# EAGLE design AudioAmp (EAGLE 7.6.0)
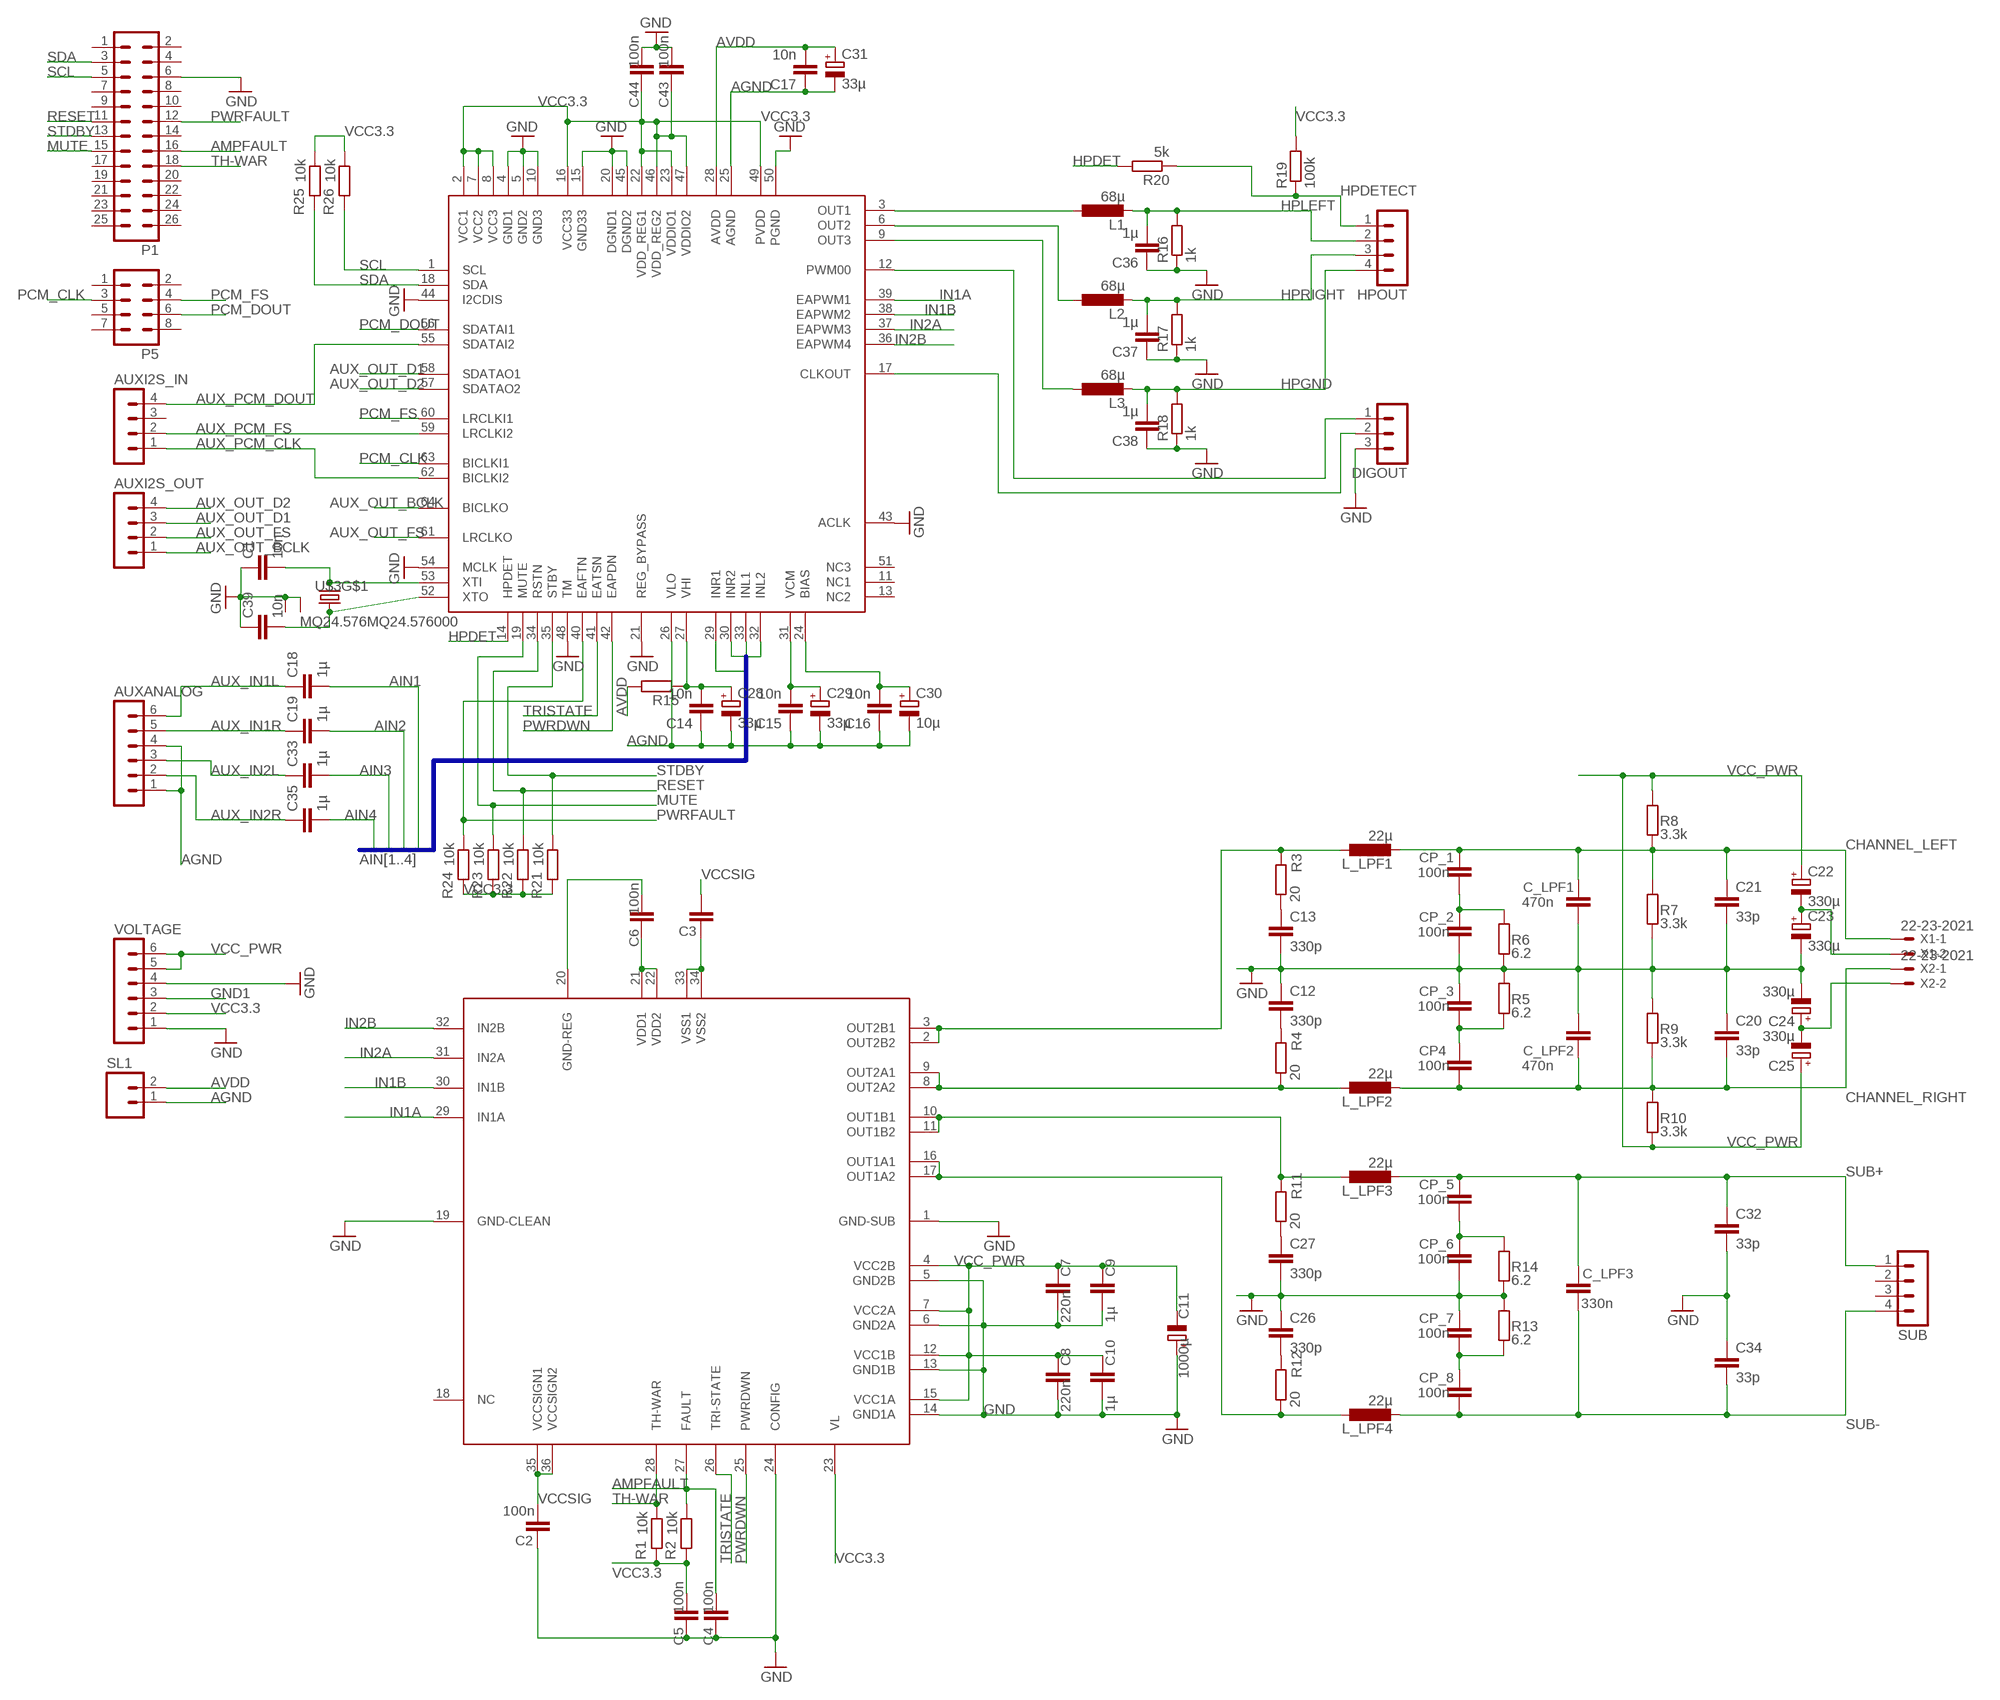
[diagram p0: schematic, sheet 1]

## Parts
AUXANALOG  MA06-1  [MA06-1]
AUXI2S_IN  MA04-1  [MA04-1]
AUXI2S_OUT  MA04-1  [MA04-1]
C1  10n  C-EUC1812  [C1812]
C2  100n  C_EU_SMD2824  [2824]
C3  C_EU_SMD2824  [2824]
C4  100n  C_EU_SMD2824  [2824]
C5  100n  C_EU_SMD2824  [2824]
C6  100n  C_EU_SMD2824  [2824]
C7  220n  C_EU_SMD2824  [2824]
C8  220n  C_EU_SMD2824  [2824]
C9  1µ  C_EU_SMD2824  [2824]
C10  1µ  C_EU_SMD2824  [2824]
C11  1000µ  CPOL-EUJ  [PANASONIC_J]
C12  330p  C-EU050-024X044  [C050-024X044]
C13  330p  C-EU050-024X044  [C050-024X044]
C14  10n  C-EUC1812  [C1812]
C15  10n  C-EUC1812  [C1812]
C16  10n  C-EUC1812  [C1812]
C17  10n  C-EUC1812  [C1812]
C18  1µ  C-EU050-045X075  [C050-045X075]
C19  1µ  C-EU050-045X075  [C050-045X075]
C20  33p  C-EU050-024X044  [C050-024X044]
C21  33p  C-EU050-024X044  [C050-024X044]
C22  330µ  CPOL-EUE2.5-7  [E2,5-7]
C23  330µ  CPOL-EUE2.5-7  [E2,5-7]
C24  330µ  CPOL-EUE2.5-7  [E2,5-7]
C25  330µ  CPOL-EUE2.5-7  [E2,5-7]
C26  330p  C-EU050-024X044  [C050-024X044]
C27  330p  C-EU050-024X044  [C050-024X044]
C28  33µ  CPOL-EUE2.5-5  [E2,5-5]
C29  33µ  CPOL-EUE2.5-5  [E2,5-5]
C30  10µ  CPOL-EUE2.5-5  [E2,5-5]
C31  33µ  CPOL-EUE2.5-5  [E2,5-5]
C32  33p  C-EU050-024X044  [C050-024X044]
C33  1µ  C-EU050-045X075  [C050-045X075]
C34  33p  C-EU050-024X044  [C050-024X044]
C35  1µ  C-EU050-045X075  [C050-045X075]
C36  1µ  C-EU050-045X075  [C050-045X075]
C37  1µ  C-EU050-045X075  [C050-045X075]
C38  1µ  C-EU050-045X075  [C050-045X075]
C39  10n  C-EUC1812  [C1812]
C43  100n  C_EU_SMD2824  [2824]
C44  100n  C_EU_SMD2824  [2824]
C_LPF1  470n  C_EU_SMD2824  [2824]
C_LPF2  470n  C_EU_SMD2824  [2824]
C_LPF3  330n  C_EU_SMD2824  [2824]
CP4  100n  C_EU_SMD2824  [2824]
CP_1  100n  C_EU_SMD2824  [2824]
CP_2  100n  C_EU_SMD2824  [2824]
CP_3  100n  C_EU_SMD2824  [2824]
CP_5  100n  C_EU_SMD2824  [2824]
CP_6  100n  C_EU_SMD2824  [2824]
CP_7  100n  C_EU_SMD2824  [2824]
CP_8  100n  C_EU_SMD2824  [2824]
DIGOUT  MA03-1  [MA03-1]
HPOUT  MA04-1  [MA04-1]
L1  68µ  L-EU0204V  [0204V]
L2  68µ  L-EU0204V  [0204V]
L3  68µ  L-EU0204V  [0204V]
L_LPF1  22µ  L-EUL-PISR  [PISR]
L_LPF2  22µ  L-EUL-PISR  [PISR]
L_LPF3  22µ  L-EUL-PISR  [PISR]
L_LPF4  22µ  L-EUL-PISR  [PISR]
P1  MA13-2  [MA13-2]
P5  MA04-2  [MA04-2]
R1  10k  R-EU_R1206  [R1206]
R2  10k  R-EU_R1206  [R1206]
R3  20  R-EU_R1206  [R1206]
R4  20  R-EU_R1206  [R1206]
R5  6.2  R-EU_R1206  [R1206]
R6  6.2  R-EU_R1206  [R1206]
R7  3.3k  R-EU_R1206  [R1206]
R8  3.3k  R-EU_R1206  [R1206]
R9  3.3k  R-EU_R1206  [R1206]
R10  3.3k  R-EU_R1206  [R1206]
R11  20  R-EU_R1206  [R1206]
R12  20  R-EU_R1206  [R1206]
R13  6.2  R-EU_R1206  [R1206]
R14  6.2  R-EU_R1206  [R1206]
R15  R-EU_0204/7  [0204/7]
R16  1k  R-EU_0204/2V  [0204V]
R17  1k  R-EU_0204/2V  [0204V]
R18  1k  R-EU_0204/2V  [0204V]
R19  100k  R-EU_0204/7  [0204/7]
R20  5k  R-EU_0204/7  [0204/7]
R21  10k  R-EU_R1206  [R1206]
R22  10k  R-EU_R1206  [R1206]
R23  10k  R-EU_R1206  [R1206]
R24  10k  R-EU_R1206  [R1206]
R25  10k  R-EU_R1206  [R1206]
R26  10k  R-EU_R1206  [R1206]
SL1  M02  [02P]
SUB  MA04-1  [MA04-1]
U$1  STA510F  [PSSO-36SD]
U$2  STA321  [LQFP-ST-64-2]
U$3  MQ24.576MQ24.576000  [MQ4]
VOLTAGE  MA06-1  [MA06-1]
X1  22-23-2021  [22-23-2021]
X2  22-23-2021  [22-23-2021]

## Nets
AGND: AUXANALOG.1 AUXANALOG.4 C14.1 C15.1 C16.1 C17.1 C28.- C29.- C30.- C31.- SL1.1 U$2.25(AGND) U$2.26(VLO)
AIN1: C18.2 U$2.33(INL1)
AIN2: C19.2 U$2.29(INR1)
AIN3: C33.2 U$2.32(INL2)
AIN4: C35.2 U$2.30(INR2)
AMPFAULT: C4.2 P1.16 R2.1 U$1.27(FAULT)
AUX_IN1L: AUXANALOG.6 C18.1
AUX_IN1R: AUXANALOG.5 C19.1
AUX_IN2L: AUXANALOG.3 C33.1
AUX_IN2R: AUXANALOG.2 C35.1
AUX_OUT_BCLK: AUXI2S_OUT.1 U$2.64(BICLKO)
AUX_OUT_D1: AUXI2S_OUT.3 U$2.58(SDATAO1)
AUX_OUT_D2: AUXI2S_OUT.4 U$2.57(SDATAO2)
AUX_OUT_FS: AUXI2S_OUT.2 U$2.61(LRCLKO)
AUX_PCM_CLK: AUXI2S_IN.1 U$2.62(BICLKI2)
AUX_PCM_DOUT: AUXI2S_IN.4 U$2.55(SDATAI2)
AUX_PCM_FS: AUXI2S_IN.2 U$2.59(LRCLKI2)
AVDD: C17.2 C31.+ R15.2 SL1.2 U$2.28(AVDD)
CHANNEL_LEFT: C21.1 C_LPF1.2 CP_1.2 L_LPF1.2 R7.2 R8.1 X1.1
CHANNEL_RIGHT: C20.2 C_LPF2.1 CP4.1 L_LPF2.2 R9.1 R10.2 X2.1
GND: C1.1 C2.1 C4.1 C5.1 C7.2 C8.2 C9.2 C10.2 C11.+ C12.1 C13.2 C20.1 C21.2 C23.- C24.- C26.1 C27.2 C32.2 C34.1 C36.1 C37.1 C38.1 C39.1 C43.2 C44.2 C_LPF1.1 C_LPF2.2 CP_2.1 CP_3.2 CP_6.1 CP_7.2 DIGOUT.3 P1.6 R5.2 R6.1 R7.1 R9.2 R13.2 R14.1 R16.1 R17.1 R18.1 U$1.1(GND-SUB) U$1.5(GND2B) U$1.6(GND2A) U$1.13(GND1B) U$1.14(GND1A) U$1.19(GND-CLEAN) U$1.24(CONFIG) U$2.4(GND1) U$2.5(GND2) U$2.10(GND3) U$2.15(GND33) U$2.20(DGND1) U$2.21(REG_BYPASS) U$2.43(ACLK) U$2.44(I2CDIS) U$2.45(DGND2) U$2.48(TM) U$2.50(PGND) U$2.54(MCLK) U$3.P$2(GND) U$3.P$4(GND) VOLTAGE.1 VOLTAGE.4
GND1: VOLTAGE.3
HPDET: R20.2 U$2.14(HPDET)
HPDETECT: HPOUT.1 R19.1 R20.1
HPGND: C38.2 HPOUT.4 L3.2 R18.2
HPLEFT: C36.2 HPOUT.2 L1.2 R16.2
HPRIGHT: C37.2 HPOUT.3 L2.2 R17.2
IN1A: U$1.29(IN1A) U$2.39(EAPWM1)
IN1B: U$1.30(IN1B) U$2.38(EAPWM2)
IN2A: U$1.31(IN2A) U$2.37(EAPWM3)
IN2B: U$1.32(IN2B) U$2.36(EAPWM4)
MUTE: P1.15 R23.1 U$2.19(MUTE)
N$1: C15.2 C29.+ U$2.31(VCM)
N$2: C16.2 C30.+ U$2.24(BIAS)
N$3: C39.2 U$2.52(XTO) U$3.P$1
N$4: C1.2 U$2.53(XTI) U$3.P$3
N$5: C3.1 U$1.33(VSS1) U$1.34(VSS2)
N$6: C6.1 U$1.21(VDD1) U$1.22(VDD2)
N$7: C6.2 U$1.20(GND-REG)
N$8: C12.2 R4.2
N$9: C13.1 R3.1
N$10: C22.- C23.+ X1.2
N$11: L_LPF2.1 R4.1 U$1.8(OUT2A2) U$1.9(OUT2A1)
N$12: L_LPF1.1 R3.2 U$1.2(OUT2B2) U$1.3(OUT2B1)
N$13: C26.2 R12.2
N$14: C27.1 R11.1
N$15: CP4.2 CP_3.1 R5.1
N$16: CP_1.1 CP_2.2 R6.2
N$17: C14.2 C28.+ R15.1 U$2.27(VHI)
N$18: C24.+ C25.- X2.2
N$19: L_LPF3.1 R11.2 U$1.10(OUT1B1) U$1.11(OUT1B2)
N$20: CP_7.1 CP_8.2 R13.1
N$21: CP_5.1 CP_6.2 R14.2
N$22: L_LPF4.1 R12.1 U$1.16(OUT1A1) U$1.17(OUT1A2)
N$24: L1.1 U$2.3(OUT1)
N$25: L2.1 U$2.6(OUT2)
N$26: L3.1 U$2.9(OUT3)
N$30: DIGOUT.1 U$2.12(PWM00)
N$31: DIGOUT.2 U$2.17(CLKOUT)
PCM_CLK: P5.3 U$2.63(BICLKI1)
PCM_DOUT: P5.6 U$2.56(SDATAI1)
PCM_FS: P5.4 U$2.60(LRCLKI1)
PWRDWN: U$1.25(PWRDWN) U$2.42(EAPDN)
PWRFAULT: P1.12 R24.1 U$2.40(EAFTN)
RESET: P1.11 R22.1 U$2.34(RSTN)
SCL: P1.5 R26.2 U$2.1(SCL)
SDA: P1.3 R25.2 U$2.18(SDA)
STDBY: P1.13 R21.1 U$2.35(STBY)
SUB+: C32.1 C_LPF3.2 CP_5.2 L_LPF3.2 SUB.1
SUB-: C34.2 C_LPF3.1 CP_8.1 L_LPF4.2 SUB.4
TH-WAR: P1.18 R1.1 U$1.28(TH-WAR)
TRISTATE: U$1.26(TRI-STATE) U$2.41(EATSN)
VCC3.3: C5.2 C43.1 C44.1 R1.2 R2.2 R19.2 R21.2 R22.2 R23.2 R24.2 R25.1 R26.1 U$1.23(VL) U$2.2(VCC1) U$2.7(VCC2) U$2.8(VCC3) U$2.16(VCC33) U$2.22(VDD_REG1) U$2.23(VDDIO1) U$2.46(VDD_REG2) U$2.47(VDDIO2) U$2.49(PVDD) VOLTAGE.2
VCC_PWR: C7.1 C8.1 C9.1 C10.1 C11.- C22.+ C25.+ R8.2 R10.1 U$1.4(VCC2B) U$1.7(VCC2A) U$1.12(VCC1B) U$1.15(VCC1A) VOLTAGE.5 VOLTAGE.6
VCCSIG: C2.2 C3.2 U$1.35(VCCSIGN1) U$1.36(VCCSIGN2)
Unconnected: AUXI2S_IN.3 P1.1 P1.2 P1.4 P1.7 P1.8 P1.9 P1.10 P1.14 P1.17 P1.19 P1.20 P1.21 P1.22 P1.23 P1.24 P1.25 P1.26 P5.1 P5.2 P5.5 P5.7 P5.8 SUB.2 SUB.3 U$1.18(NC) U$2.11(NC1) U$2.13(NC2) U$2.51(NC3)

## Buses
AIN[1..4]

## Library data of the parts
AUXANALOG VOLTAGE = con-lstb:MA06-1: PIN HEADER; OC_FARNELL: unknown; OC_NEWARK: unknown
AUXI2S_IN AUXI2S_OUT HPOUT SUB = con-lstb:MA04-1: PIN HEADER; OC_FARNELL: unknown; OC_NEWARK: unknown
C1 C12-C21 C26 C27 C32-C39 = rcl:C-EU: CAPACITOR, European symbol
C2-C10 C43 C44 C_LPF1-C_LPF3 CP4 CP_1-CP_3 CP_5-CP_8 = cap_smd_2824:C_EU_SMD*: Author: Dipl.-Ing. FH Rainer Bayer rainer.bayer@hs-heilbronn.de
C11 C22-C25 C28-C31 = rcl:CPOL-EU: POLARIZED CAPACITOR, European symbol
DIGOUT = con-lstb:MA03-1: PIN HEADER; OC_FARNELL: unknown; OC_NEWARK: unknown
L1-L3 L_LPF1-L_LPF4 = rcl:L-EU: INDUCTOR, European symbol
P1 = con-lstb:MA13-2: PIN HEADER; OC_FARNELL: unknown; OC_NEWARK: unknown
P5 = con-lstb:MA04-2: PIN HEADER; OC_FARNELL: unknown; OC_NEWARK: unknown
R1-R26 = rcl:R-EU_: RESISTOR, European symbol
SL1 = con-amp-quick:M02: AMP QUICK CONNECTOR; OC_FARNELL: unknown; OC_NEWARK: unknown
U$1 = ClassD_Amp:STA510F
U$2 = ClassD_Amp:STA321: STA321 4-channel digital audio system
U$3 = crystal:MQ24.576
X1 X2 = con-molex:22-23-2021: .100" (2.54mm) Center Header - 2 Pin; MF: MOLEX; MPN: 22-23-2021; OC_FARNELL: 1462926; OC_NEWARK: 25C3832

## Board
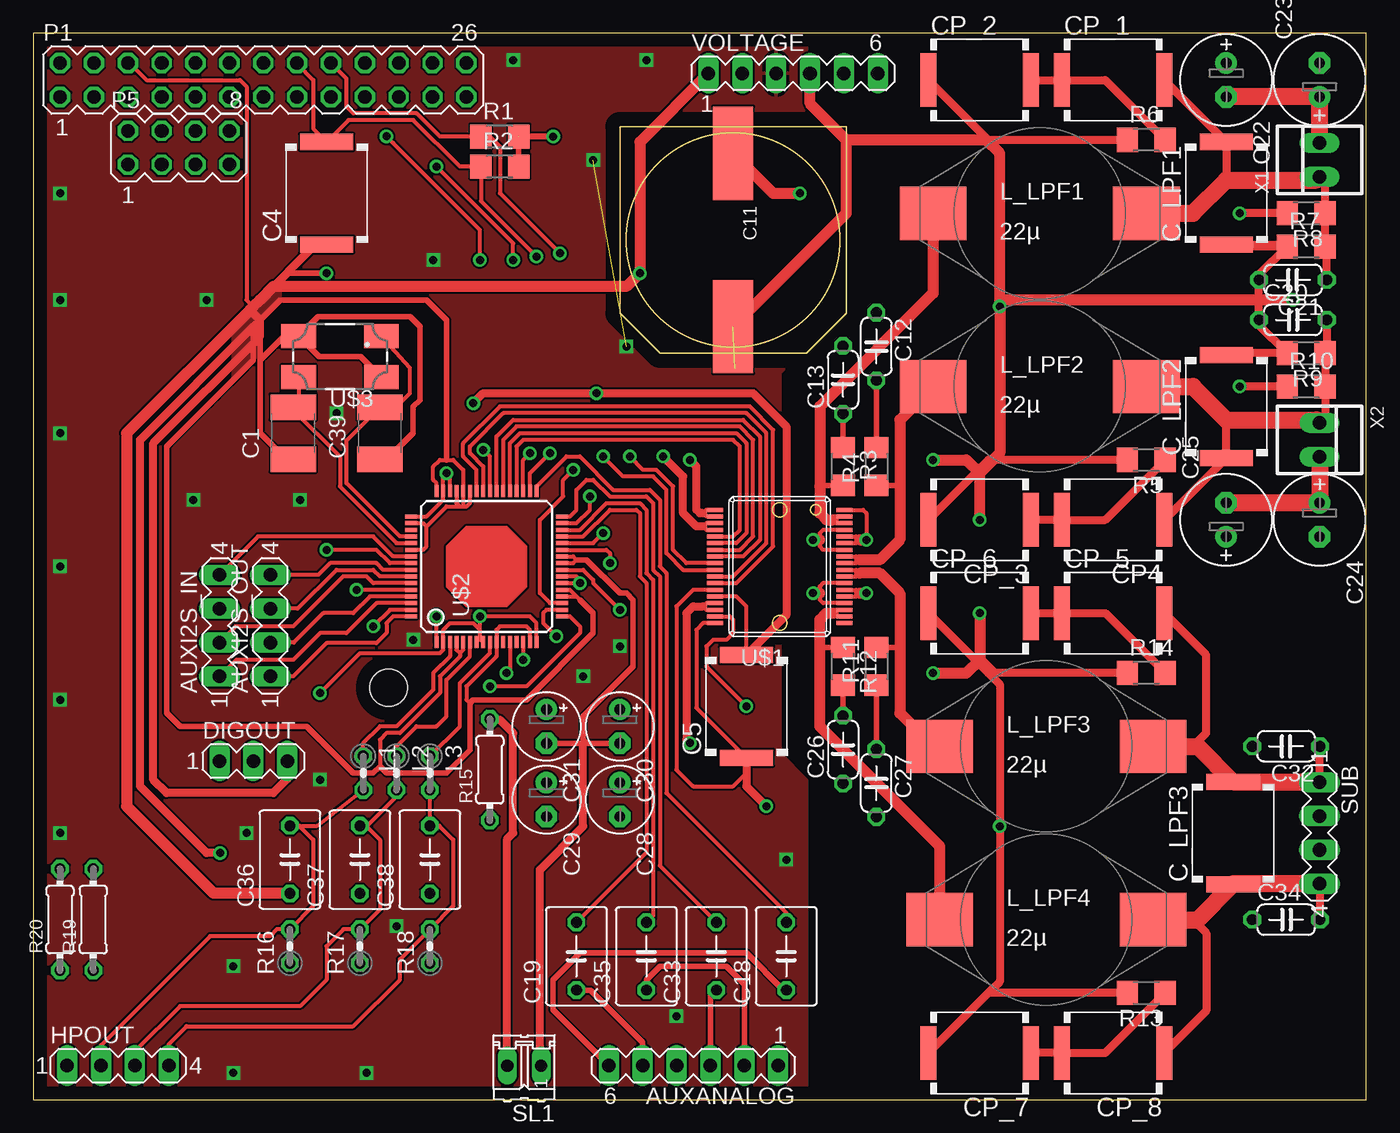
[diagram p1: board, top side]
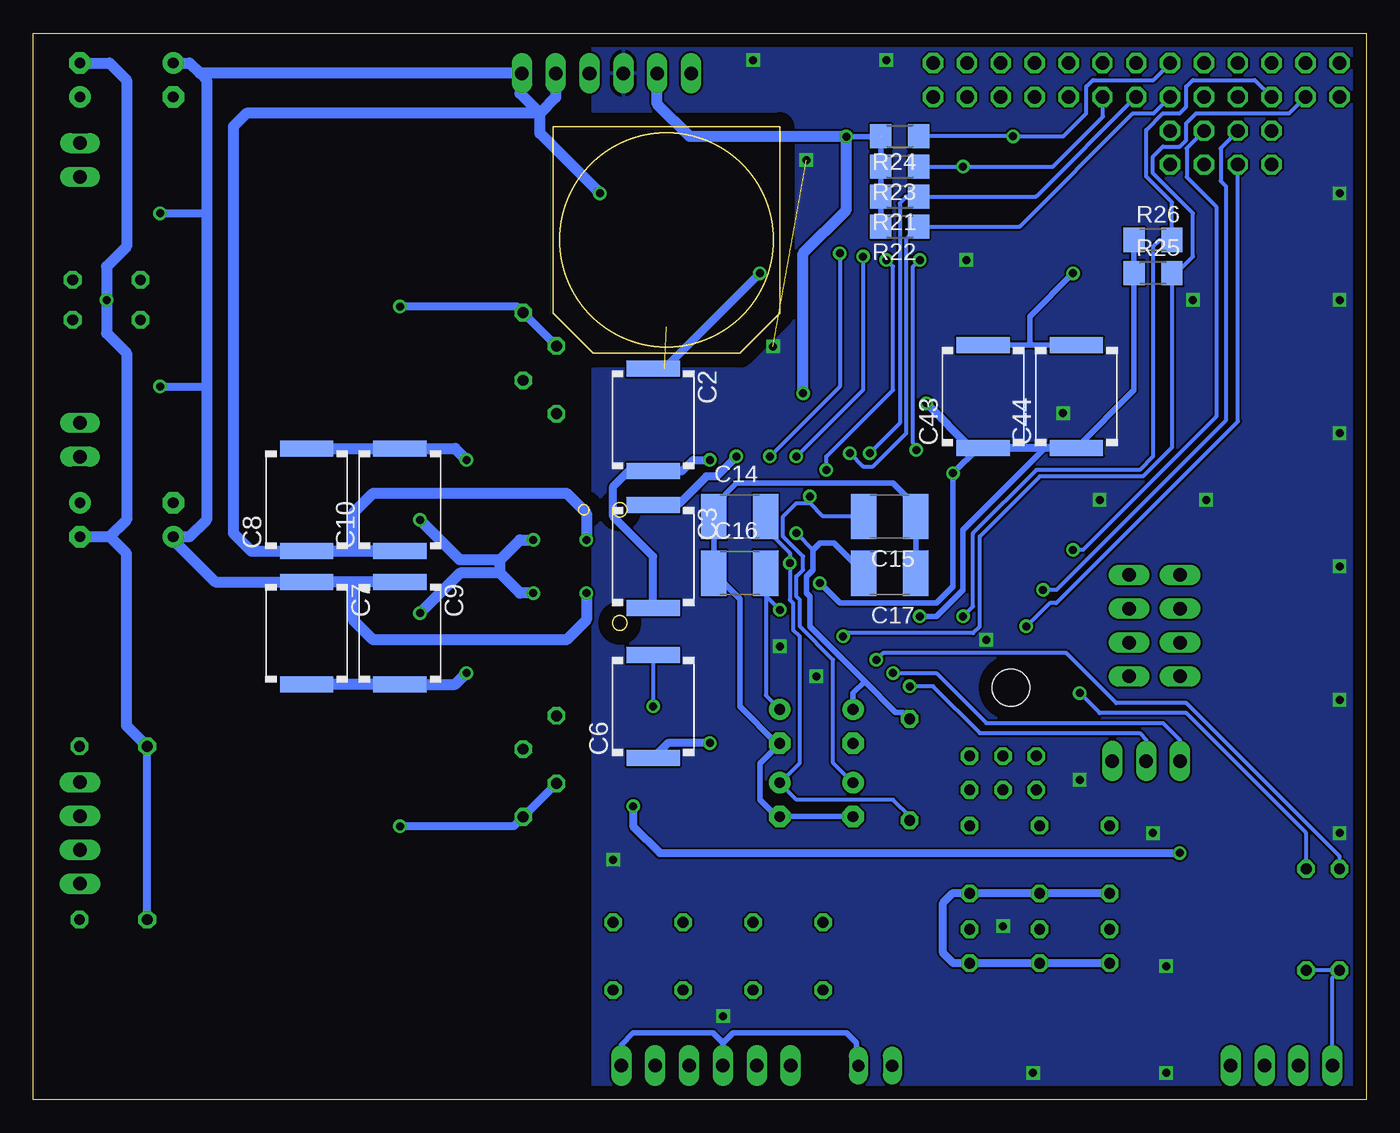
[diagram p2: board, bottom side, seen from below]

Size 100 x 80 mm. Coordinates in mm from the lower left corner, seen from the top.
Outline: 0,0 100,0 100,80 0,80 0,0
Copper layers (1*16): Top 0.035mm / dielectric 1.5mm / Bottom 0.035mm
Design rules "default *": minimum track width 0.15mm, minimum drill 0.3mm, track to track 0.15mm, track to pad 0.15mm, pad to pad 0.15mm, via to via 0.15mm, smd to smd 0.15mm, copper to edge 40mil, drill to drill 0.4mm, minimum pad ring 10mil, minimum via ring 8mil, stop-mask expansion 4mil, vias tented up to drill 0mil, thermal gap 10mil
Holes 2.8 mm at 26.65,30.9

### Footprints (pad centres in the part's own frame; a part is rotated, then mirrored left to right if it is on the bottom)
MA06-1 = drill 1.016 long: 1 -6.35,0; 2 -3.81,0; 3 -1.27,0; 4 1.27,0; 5 3.81,0; 6 6.35,0
MA04-1 = drill 1.016 long: 1 -3.81,0; 2 -1.27,0; 3 1.27,0; 4 3.81,0
C1812 = smd 1.9 x 3.4: 1 -1.95,0; 2 1.95,0
2824 = smd 1.2 x 4: 1 -3.85,0; 2 3.85,0
PANASONIC_J = smd 7 x 3: + 6.5,0; - -6.5,0
C050-024X044 = drill 0.813 octagon: 1 -2.54,0; 2 2.54,0
C050-045X075 = drill 0.813 octagon: 1 -2.54,0; 2 2.54,0
E2,5-7 = drill 0.813 pad 1.6: + -1.27,0 | drill 0.813 pad 1.6 octagon: - 1.27,0
E2,5-5 = drill 0.813 pad 1.6: + -1.27,0 | drill 0.813 pad 1.6 octagon: - 1.27,0
MA03-1 = drill 1.016 long: 1 -2.54,0; 2 0,0; 3 2.54,0
0204V = drill 0.813 octagon: 1 -1.27,0; 2 1.27,0
PISR = smd 5 x 4: 1 -8,0; 2 8,0
MA13-2 = drill 1.016 octagon: 1 -15.24,-1.27; 2 -15.24,1.27; 3 -12.7,-1.27; 4 -12.7,1.27; 5 -10.16,-1.27; 6 -10.16,1.27; 7 -7.62,-1.27; 8 -7.62,1.27; 9 -5.08,-1.27; 10 -5.08,1.27; 11 -2.54,-1.27; 12 -2.54,1.27; 13 0,-1.27; 14 0,1.27; 15 2.54,-1.27; 16 2.54,1.27; 17 5.08,-1.27; 18 5.08,1.27; 19 7.62,-1.27; 20 7.62,1.27; 21 10.16,-1.27; 22 10.16,1.27; 23 12.7,-1.27; 24 12.7,1.27; 25 15.24,-1.27; 26 15.24,1.27
MA04-2 = drill 1.016 octagon: 1 -3.81,-1.27; 2 -3.81,1.27; 3 -1.27,-1.27; 4 -1.27,1.27; 5 1.27,-1.27; 6 1.27,1.27; 7 3.81,-1.27; 8 3.81,1.27
R1206 = smd 1.6 x 1.803: 1 -1.422,0; 2 1.422,0
0204/7 = drill 0.813 octagon: 1 -3.81,0; 2 3.81,0
02P = drill 0.914 long: 1 -1.27,0; 2 1.27,0
PSSO-36SD = smd 0.3 x 1.2: 1 -4.25,4.85; 2 -3.75,4.85; 3 -3.25,4.85; 4 -2.75,4.85; 5 -2.25,4.85; 6 -1.75,4.85; 7 -1.25,4.85; 8 -0.75,4.85; 9 -0.25,4.85; 10 0.25,4.85; 11 0.75,4.85; 12 1.25,4.85; 13 1.75,4.85; 14 2.25,4.85; 15 2.75,4.85; 16 3.25,4.85; 17 3.75,4.85; 18 4.25,4.85; 19 4.25,-4.85; 20 3.75,-4.85; 21 3.25,-4.85; 22 2.75,-4.85; 23 2.25,-4.85; 24 1.75,-4.85; 25 1.25,-4.85; 26 0.75,-4.85; 27 0.25,-4.85; 28 -0.25,-4.85; 29 -0.75,-4.85; 30 -1.25,-4.85; 31 -1.75,-4.85; 32 -2.25,-4.85; 33 -2.75,-4.85; 34 -3.25,-4.85; 35 -3.75,-4.85; 36 -4.25,-4.85
LQFP-ST-64-2 = smd 0.9 x 0.3: 1 -5.65,3.75; 2 -5.65,3.25; 3 -5.65,2.75; 4 -5.65,2.25; 5 -5.65,1.75; 6 -5.65,1.25; 7 -5.65,0.75; 8 -5.65,0.25; 9 -5.65,-0.25; 10 -5.65,-0.75; 11 -5.65,-1.25; 12 -5.65,-1.75; 13 -5.65,-2.25; 14 -5.65,-2.75; 15 -5.65,-3.25; 16 -5.65,-3.75; 33 5.65,-3.75; 34 5.65,-3.25; 35 5.65,-2.75; 36 5.65,-2.25; 37 5.65,-1.75; 38 5.65,-1.25; 39 5.65,-0.75; 40 5.65,-0.25; 41 5.65,0.25; 42 5.65,0.75; 43 5.65,1.25; 44 5.65,1.75; 45 5.65,2.25; 46 5.65,2.75; 47 5.65,3.25; 48 5.65,3.75 | smd 0.3 x 0.9: 17 -3.75,-5.65; 18 -3.25,-5.65; 19 -2.75,-5.65; 20 -2.25,-5.65; 21 -1.75,-5.65; 22 -1.25,-5.65; 23 -0.75,-5.65; 24 -0.25,-5.65; 25 0.25,-5.65; 26 0.75,-5.65; 27 1.25,-5.65; 28 1.75,-5.65; 29 2.25,-5.65; 30 2.75,-5.65; 31 3.25,-5.65; 32 3.75,-5.65; 49 3.75,5.65; 50 3.25,5.65; 51 2.75,5.65; 52 2.25,5.65; 53 1.75,5.65; 54 1.25,5.65; 55 0.75,5.65; 56 0.25,5.65; 57 -0.25,5.65; 58 -0.75,5.65; 59 -1.25,5.65; 60 -1.75,5.65; 61 -2.25,5.65; 62 -2.75,5.65; 63 -3.25,5.65; 64 -3.75,5.65
MQ4 = smd 2.6 x 1.8: P$1 -3.1,-1.55; P$2 3.1,-1.55; P$3 3.1,1.55; P$4 -3.1,1.55
22-23-2021 = drill 1 long: 1 -1.27,0; 2 1.27,0

### Placement (x,y rotation side)
AUXANALOG  49.53,2.54 180 top
AUXI2S_IN  13.97,35.56 90 top
AUXI2S_OUT  17.78,35.56 90 top
C1  19.5,50 90 top
C2  53.5,51 270 bottom
C3  53.5,40.75 270 bottom
C4  22,68 90 top
C5  53.5,29.5 90 top
C6  53.5,29.5 90 bottom
C7  79.5,35 270 bottom
C8  79.5,45 90 bottom
C9  72.5,35 270 bottom
C10  72.5,45 90 bottom
C11  52.5,64.5 270 top
C12  63.25,56.5 270 top
C13  60.75,54 90 top
C14  47,43.75 0 bottom
C15  35.75,43.75 180 bottom
C16  47,39.5 0 bottom
C17  35.75,39.5 180 bottom
C18  56.5,10.75 90 top
C19  40.75,10.75 90 top
C20  94.5,58.5 0 top
C21  94.5,61.5 180 top
C22  89.5,76.5 270 top
C23  96.5,76.5 90 top
C24  96.5,43.5 270 top
C25  89.5,43.5 90 top
C26  60.75,26.25 90 top
C27  63.25,23.75 270 top
C28  44,22.5 270 top
C29  38.5,22.5 270 top
C30  44,28 270 top
C31  38.5,28 270 top
C32  94,26.5 180 top
C33  51.25,10.75 90 top
C34  94,13.5 0 top
C35  46,10.75 90 top
C36  19.25,18 90 top
C37  24.5,18 90 top
C38  29.75,18 90 top
C39  26,50 90 top
C43  28.75,52.75 90 bottom
C44  21.75,52.75 90 bottom
C_LPF1  89.5,68 90 top
C_LPF2  89.5,52 90 top
C_LPF3  90,20 90 top
CP4  81,43.5 180 top
CP_1  81,76.5 0 top
CP_2  71,76.5 0 top
CP_3  71,43.5 180 top
CP_5  81,36.5 0 top
CP_6  71,36.5 0 top
CP_7  71,3.5 180 top
CP_8  81,3.5 180 top
DIGOUT  16.51,25.4 0 top
HPOUT  6.35,2.54 0 top
L1  24.75,24.5 270 top
L2  27.25,24.5 270 top
L3  29.75,24.5 270 top
L_LPF1  75.5,66.5 0 top
L_LPF2  75.5,53.5 0 top
L_LPF3  76,26.5 0 top
L_LPF4  76,13.5 0 top
P1  17.25,76.5 0 top
P5  10.9,71.42 0 top
R1  35,72.25 0 top
R2  35,70 0 top
R3  60.75,47.5 270 top
R4  63.25,47.5 90 top
R5  83.5,48 180 top
R6  83.5,72 0 top
R7  95.5,64 0 top
R8  95.5,66.5 180 top
R9  95.5,56 180 top
R10  95.5,53.5 0 top
R11  63.25,32.5 90 top
R12  60.75,32.5 270 top
R13  83.5,8 180 top
R14  83.5,32 0 top
R15  34.25,24.75 90 top
R16  19.25,11.5 90 top
R17  24.5,11.5 90 top
R18  29.75,11.5 90 top
R19  4.5,13.5 90 top
R20  2,13.5 90 top
R21  35,67.75 180 bottom
R22  35,65.5 180 bottom
R23  35,70 180 bottom
R24  35,72.27 180 bottom
R25  16,62 0 bottom
R26  16,64.5 0 bottom
SL1  36.83,2.54 180 top
SUB  96.5,20 270 top
U$1  56,40 270 top
U$2  34,40 90 top
U$3  23,55.75 180 top
VOLTAGE  57,77 0 top
X1  96.5,70.5 90 top
X2  96.5,49.5 270 top

### Tracks (layer width: path | path; a pad name or v marks a point on that pad's centre or on a via)
AGND  (via drill 0.6)
  Top 0.305: U$2.26 40.5,40.75 40.75,40.5 40.5,40.25 U$2.25
  Top 0.406: C31.- 41.25,26.73 41.5,26.73 | 41.5,26.73 C30.- | 40.75,40.5 41.5,40.5 44,38 44.5,38 45,37.5 45,32.5 41.25,28.75 41.25,26.98 41.5,26.73
  Top 0.61: v38,2.5 38,17.25 41.25,20.5 41.25,26.73
  Bottom 0.406: C29.- C28.- 44.23,21.23 45.5,22.5 45.5,25.23 C30.- 44.23,26.73 47,29.5 47,37.55 C16.1 C14.1 48.95,44.55 47.25,46.25 35.5,46.25 33.8,44.55 C17.1 C15.1 | AUXANALOG.1 55.88,4.12 55,5 49,5 48.25,4.25 AUXANALOG.4 48.26,4.24 47.5,5 39,5 38.25,4.25 38.25,2.75 | 38.25,2.75 38.25,2.69 SL1.1 | 38.25,2.75 v38,2.5
AIN1
  Top 0.305: U$2.33 37.75,46 40,48.25 41,48.25 43.5,45.75 46.25,45.75 47,45 47,40 47.5,39.5 47.5,23 56.5,14 C18.2
AIN2
  Top 0.305: U$2.29 41.25,42.25 43.25,44.25 45.25,44.25 45.5,44 45.5,39.25 46,38.75 46,18.54 C19.2
AIN3
  Top 0.305: U$2.32 40.25,43.75 40.75,44.25 40.75,45.75 41.5,46.5 42,46.5 43.25,45.25 46,45.25 46.5,44.75 46.5,39.75 47,39.25 47,17.54 C33.2
AIN4
  Top 0.305: U$2.30 41,42.75 43,44.75 45.5,44.75 46,44.25 46,39.5 46.5,39 46.5,13.79 C35.2
AMPFAULT  (via drill 0.6)
  Top 0.305: P1.16 19.79,77.71 21,76.5 21,72.85 C4.2 23.65,73.5 28.5,73.5 32,70 R2.1 33.58,67.42 v37.75,63.25 | U$1.27 48.75,39.75 47.5,41 47.5,45.75 46.5,46.75 44.25,46.75 v42.75,48.25
  Bottom 0.305: v37.75,63.25 37.75,53.25 v42.75,48.25
AUX_IN1L
  Top 0.406: C18.1 56.29,8.21 53.5,11 41,11 39,9 39,6.72 AUXANALOG.6
AUX_IN1R
  Top 0.406: C19.1 41.79,8.21 45.72,4.28 AUXANALOG.5
AUX_IN2L
  Top 0.406: C33.1 50.8,7.76 AUXANALOG.3
AUX_IN2R
  Top 0.406: C35.1 46,9 47,10 52,10 53.34,8.66 AUXANALOG.2
AUX_OUT_BCLK
  Top 0.305: U$2.64 27,36.25 26.5,35.75 26.5,35 25.75,34.25 22,34.25 19.5,31.75 AUXI2S_OUT.1
AUX_OUT_D1
  Top 0.305: U$2.58 26,39.25 25.5,39.75 22.75,39.75 19.83,36.83 AUXI2S_OUT.3
AUX_OUT_D2
  Top 0.305: U$2.57 26.25,39.75 25.75,40.25 22.25,40.25 21.37,39.37 AUXI2S_OUT.4
AUX_OUT_FS
  Top 0.305: U$2.61 25.25,37.75 24,36.5 21.75,36.5 19.54,34.29 AUXI2S_OUT.2
AUX_PCM_CLK
  Top 0.305: U$2.62 25.75,37.25 23.5,35 21.5,35 19.5,33 15.22,33 AUXI2S_IN.1
AUX_PCM_DOUT
  Top 0.305: U$2.55 27,40.75 25.5,42.25 16.85,42.25 AUXI2S_IN.4
AUX_PCM_FS
  Top 0.305: U$2.59 25.5,38.75 25,39.25 23.25,39.25 19.5,35.5 15.18,35.5 AUXI2S_IN.2
AVDD  (via drill 0.6)
  Top 0.305: U$2.28 42,41.75 v42.75,42.5
  Top 0.61: SL1.2 35.56,19.56 36,20 36,27.5 35,28.5 34.31,28.5 R15.2
  Bottom 0.305: C17.2 37.7,39.8 | v42.75,42.5 41.5,41.25
  Bottom 0.406: 37.62,31.38 35.31,29.06 34.75,29.06 R15.2 | C17.2 39.95,41.75 41,41.75 41.5,41.25 41.5,39.75 42,39.25 42,38 41.75,37.75 41.75,35.5 37.62,31.38 | C31.+ 38.5,30.5 37.62,31.38
CHANNEL_LEFT
  Top 0.61: CP_1.2 C_LPF1.2 89.5,69 | X1.1 96.92,68.81 R8.1 R7.2 97.04,63.88 C21.1
  Top 1.27: L_LPF1.2 87,66.5 89.5,69 96.27,69 X1.1
CHANNEL_RIGHT
  Top 0.61: 89.5,51 C_LPF2.1 CP4.1 | C20.2 97.04,56.12 R9.1 R10.2 96.92,51.19 X2.1
  Top 1.27: L_LPF2.2 87,53.5 89.5,51 96.27,51 X2.1
GND  (via drill 0.6)  (1 unrouted)
  Top 0.254: 94,64 92,62 92,60
  Top 0.305: U$1.5 61.75,42.25 62,42 61.75,41.75 U$1.6 | U$1.14 61.75,37.75 62,38 61.75,38.25 U$1.13 | U$1.1 62.25,44.25 62.5,44 v62.5,42 | U$1.24 49.5,38.25 48.25,37 48.25,24.75 49.5,23.5 52.5,23.5 53.5,24.5 53.5,25.5 C5.1 49.75,29.4 49.75,35.25 50.25,35.75 U$1.19 | P1.6 7.23,77.77 8.5,76.5 15.5,76.5 16,76 16,60 16.5,59.5 | U$2.50 29.25,43.25 29.5,43 | U$2.54 29.25,41.25 29.5,41.5 29.5,43 | U$2.45 31.75,44.75 32,44.5 | 32,44.5 32.25,44.5 | 32.25,44.5 32.5,44.5 32.75,44.75 U$2.43 | 32.25,44.5 U$2.44 32.25,47.25 31.5,48 31,48 30.5,48 30,47.5 30,46.5 30.25,46.25 U$2.48 | 29.5,43 31,44.5 32,44.5 | 32,33.5 32.25,33.75 U$2.5 | U$2.4 31.75,33.75 32,33.5 | 32,33.5 32,33.25 30.5,31.75 30.5,30.5 27.5,27.5 26.5,27.5 26,27 26,25 | U$2.15 37.25,35.25 37,35.5 35,35.5 34.75,35.25 U$2.10 34.75,33.25 32.5,31 32.5,30 32.75,29.75 | U$2.20 40.75,37.75 | 40.75,37.75 41,37.5 | U$2.21 40.25,38.25 40.75,37.75
  Top 0.406: U$3.P$2 21.45,55.75 24.55,55.75 U$3.P$4 | C1.1 18.95,48.05 17,50 17,55.5 | 17,55.5 18.8,57.3 U$3.P$2 | C39.1 26.55,48.05 28.5,50 28.5,52 29,52.5 29,58 28.25,58.75 21.35,58.75 U$3.P$2 | 17,55.5 17,58.5 18.5,60 29.5,60 31,58.5 31,48 | v22,62 19,62 16.25,59.25 | 16.5,58 16.5,55.5 10,49 10,29 11,28 20.5,28 24,24.5 25.5,24.5 26,25 26.5,24.5 31,24.5 32.75,26.25 32.75,29.75 33,30 37,30 42,35 42,36.5 41,37.5
  Top 0.61: R13.2 71.65,8 | 71.65,8 CP_7.2 | R5.2 72,48 71.65,48 CP_3.2 | CP_2.1 71.65,72 R6.1 71.5,72 | C_LPF2.2 89.65,56 R9.2 91.96,58.12 C20.1 91.96,60 C21.2 91.96,61.88 R7.1 | 94,64 89.65,64 C_LPF1.1 93.85,64.15 94,64 | 71.65,8 72.5,8.85 v72.5,20.5 C9.2 71.65,32 | 72.5,60 v72.5,59.5 | 71.65,32 CP_6.1 | R14.1 72,32 71.65,32 | 94.5,64 94,64 | C4.1 21.15,64.15 17,60 | 53.5,25.5 53.5,23.5 v55,22 | v14,18.5 13,18.5 8,23.5 8,49.5 16.5,58 17,58.5 | DIGOUT.3 19.05,24.05 18,23 10,23 9,24 9,49.25 17,57.25 17,58.5 | 17,58.5 16.25,59.25
  Top 0.813: 62,38 v62.5,38 | 62,42 v62.5,42 | v71,43.5 71,47 | 71,47 72,48 72.5,48.5 v72.5,59.5 | v71,36.5 71,33 | 71,33 72,32 | v67.5,32 70,32 71,33 | v67.5,48 70,48 71,47 | v94.5,60 92,60 91.96,60 72.5,60 72.5,71 71.5,72 61,72 | 61,72 58.27,74.73 VOLTAGE.4 | C11.+ 61,66.5 61,72 | VOLTAGE.1 45.5,71.85 v45.5,62 44.5,61 18,61 17,60 16.5,59.5 16.25,59.25 7,50 7,22 13.5,15.5 19.21,15.5 C36.1
  Bottom 0.406: C43.2 C44.2 25.1,56.6 25.25,56.75 25.25,58.75 v22,62
  Bottom 0.61: C34.1 C32.2 | v72.5,20.5 63.96,20.5 C27.2 C26.1 | C13.2 C12.1 63.71,59.5 v72.5,59.5 | C36.1 C37.1 C38.1 29.79,15.5 31,15.5 31.75,14.75 31.75,11 30.98,10.23 R18.1 R17.1 R16.1 | C2.1 52.65,54.85 v45.5,62 | v55,22 55,20.5 53,18.5 v14,18.5
  Bottom 0.813: v62.5,38 63.5,38 65,39.5 | 65,39.5 65,40.5 | 65,40.5 63.5,42 v62.5,42 | 65,39.5 68,39.5 v71,36.5 | 65,40.5 68,40.5 v71,43.5 | C7.2 C9.2 68.35,31.15 v67.5,32 | C8.2 C10.2 68.35,48.85 v67.5,48 | C23.- 94.27,77.77 93,76.5 93,64 94.5,62.5 v94.5,60 94.5,57.5 93,56 93,43.5 94.27,42.23 | C24.- 94.27,42.23 | C32.2 93,28.04 93,40.96 94.27,42.23
  pour Top: 18,61 15,58 15,54 17,56 17,58.5 18.5,60 18.5,61
GND1  (via drill 0.6)  (1 unrouted)
  other vias: 2,68 2,60 2,50 2,40 12,45 30,63 20,45 41.25,31.75 56.5,18 25,2 15,2 2,20 2,30 16,20 36,78 46,78 15,10 44,34 28.5,34.5 21.5,24 22.75,51.5 27.25,13 48.25,6.25 13,60 42,70.5 44.5,56.5
  pour Bottom: 0,80 0,0 58,0 58,80 0.5,80
  pour Top: 0,80 0,0 58,0 58,24 56,26 56,54.5 58,56.5 58,80
HPDET  (via drill 0.6)
  Top 0.305: U$2.14 v36.75,33
  Bottom 0.305: R20.2 2,18.25 13.5,29.75 18.75,29.75 22.5,33.5 36.25,33.5 v36.75,33
HPDETECT
  Bottom 0.305: R19.1 R20.1 2.54,9.15 HPOUT.1
HPGND
  Top 0.305: L3.2 C38.2 30.46,20.54 31.5,19.5 31.5,14.52 R18.2 27.5,10.52 27.5,9 24,5.5 11.5,5.5 10.16,4.16 HPOUT.4
HPLEFT
  Top 0.305: L1.2 21.31,20.54 C36.2 19.96,20.54 21,19.5 21,14.52 R16.2 18.27,12.77 17.75,12.25 13.25,12.25 5.08,4.08 HPOUT.2
HPRIGHT
  Top 0.305: L2.2 27.25,22.75 25.04,20.54 C37.2 24.96,20.54 26,19.5 26,14.27 R17.2 23.27,12.77 22,11.5 22,9 20,7 11,7 7.62,3.62 HPOUT.3
IN1A
  Top 0.305: U$2.39 34.75,49.75 36,51 53.25,51 54.5,49.75 54.5,42 53.25,40.75 U$1.29
IN1B
  Top 0.305: U$1.30 53,41.25 54,42.25 54,49.5 53,50.5 36.25,50.5 35.25,49.5 U$2.38
IN2A
  Top 0.305: U$2.37 35.75,49.25 36.5,50 52.75,50 53.5,49.25 53.5,42.5 52.75,41.75 U$1.31
IN2B
  Top 0.305: U$1.32 52.5,42.25 53,42.75 53,49 52.5,49.5 36.75,49.5 36.25,49 U$2.36
MUTE  (via drill 0.6)
  Top 0.305: U$2.19 38.75,37.25 38,38 38,43.5 39.75,45.25 39.75,46.5 v40.5,47.25 | v36,63 36,64.25 v30.25,70
  Bottom 0.305: R23.1 v30.25,70 23.5,70 19.75,73.75 19.75,75.19 P1.15 | v36,63 35.5,62.5 35.5,53.25 40,48.75 40.25,48.5 40.5,48.25 v40.5,47.25
N$1  (via drill 0.6)
  Top 0.305: U$2.31 40.75,43.25 41.75,44.25 v41.75,45.25
  Bottom 0.305: C15.2 40.75,43.75 41.75,44.75 | 41.75,44.75 v41.75,45.25 | C29.+ 38.52,23.77 40,25.25 40,33 42.5,35.5 42.5,37.5 42.75,37.75 42.75,39.25 42.25,39.75 42.25,40.75 43.75,42.25 43.75,43.75 42.75,44.75 41.75,44.75
N$2  (via drill 0.6)
  Top 0.305: U$2.24 41.25,39.75 42,39 42,38.75 v44,36.75
  Bottom 0.305: C30.+ 45.05,30.32 C16.2 45.05,37.8 v44,36.75
N$3
  Top 0.305: U$2.52 27.5,42.25 23.5,46.25 23.5,49.45 C39.2 26.95,51.7 28.25,53 28.25,54.9 U$3.P$1
N$4
  Top 0.305: U$2.53 27.25,41.75 23,46 23,48.25 19.5,51.75 C1.2 19.9,52.35 U$3.P$3
N$5  (via drill 0.6)
  Top 0.305: U$1.33 50.5,42.75 50.25,43 50.5,43.25 U$1.34
  Top 0.61: 50.25,43 49.75,43 48.75,44 48.75,46.75 v47.25,48.25
  Bottom 0.61: v47.25,48.25 48.75,46.75 49.5,46.75 51.5,44.75 53.35,44.75 C3.1
N$6  (via drill 0.6)
  Top 0.305: U$1.22 50.5,37.25 50.25,37 50.5,36.75 U$1.21
  Top 0.61: 50.25,37 49.5,37 49,36.5 49,27 v49.25,26.75
  Bottom 0.61: v49.25,26.75 52.4,26.75 C6.1
N$7  (via drill 0.6)
  Top 0.305: U$1.20 52.25,36.25 52.5,36 52.5,35 52,34.5 51,34.5 50.5,34 50.5,32.5 v53.5,29.5
  Bottom 0.305: C6.2 v53.5,29.5
N$8
  Top 0.406: R4.2 C12.2
N$9
  Top 0.406: R3.1 C13.1
N$10
  Top 1.27: X1.2 C23.+ C22.-
N$11
  Top 0.305: U$1.9 61.75,40.25 62,40.5 61.75,40.75 U$1.8
  Top 0.406: R4.1 64.92,46.08 65,46
  Top 0.813: L_LPF2.1 65,51 65,46 65,42 63.5,40.5 62,40.5
N$12
  Top 0.305: U$1.2 60.25,43.75 60,43.5 60.25,43.25 U$1.3
  Top 0.406: R3.2 59.08,46.08 59,46
  Top 0.813: L_LPF1.1 67.5,60.5 59,52 59,46 59,44 59.5,43.5 60,43.5
N$13
  Top 0.406: R12.2 C26.2
N$14
  Top 0.406: C27.1 R11.1
N$15
  Top 0.61: R5.1 80.42,43.5 CP4.2 CP_3.1
N$16
  Top 0.61: R6.2 80.42,76.5 CP_1.1 CP_2.2
N$17  (via drill 0.6)
  Top 0.305: U$2.27 43,41.25 43.25,41 v43.25,40.25
  Bottom 0.305: C14.2 45.05,42.8 43.25,41 v43.25,40.25 43.25,37.5 43,37.25 43,35.25 42.5,34.75 42.5,25.25 43.98,23.77 C28.+ 42.73,22.5 35.5,22.5 34.25,21.25 R15.1
N$18
  Top 1.27: X2.2 C24.+ C25.-
N$19
  Top 0.305: U$1.11 61.75,39.25 62,39.5 61.75,39.75 U$1.10
  Top 0.406: R11.2 64.92,33.92 65,34
  Top 0.813: L_LPF3.1 67.5,26.5 | 67.5,26.5 66,26.5 | 62,39.5 63.5,39.5 65,38 65,34 65,29 67.5,26.5
N$20
  Top 0.61: R13.1 80.42,3.5 CP_8.2 CP_7.1
N$21
  Top 0.61: R14.2 80.42,36.5 CP_5.1 CP_6.2
N$22
  Top 0.305: U$1.16 60.25,36.75 60,36.5 60.25,36.25 U$1.17
  Top 0.406: R12.1 59.08,33.92 59,34
  Top 0.813: L_LPF4.1 68,19 59,28 59,34 59,36 59.5,36.5 60,36.5
N$24
  Top 0.305: L1.1 24.75,26.75 26,28 27.25,28 30,30.75 30,32 31.25,33.25 U$2.3
N$25
  Top 0.305: L2.1 27.25,26.5 28.75,28 30.25,28 31,28.75 31,31.5 32.75,33.25 U$2.6
N$26
  Top 0.305: L3.1 29.77,25.77 32,28 32,31.25 34.25,33.5 U$2.9
N$30  (via drill 0.6)
  Top 0.305: U$2.12 35.75,32.25 v35.5,32
  Bottom 0.305: v35.5,32 32.25,32 28.5,28.25 15.25,28.25 14,27 14,25.43 DIGOUT.1
N$31  (via drill 0.6)
  Top 0.305: U$2.17 40.25,36.25 41,35.5 41,35 37,31 v34.25,31
  Bottom 0.305: v34.25,31 32.5,31 29,27.5 17,27.5 16.5,27 DIGOUT.2
PCM_CLK  (via drill 0.6)
  Top 0.305: U$2.63 26.75,36.75 v25.5,35.5
  Bottom 0.305: P5.3 9.63,50.87 23.25,37.25 23.75,37.25 v25.5,35.5
PCM_DOUT  (via drill 0.6)
  Top 0.305: U$2.56 26.75,40.25 25.75,41.25 v22,41.25
  Bottom 0.305: P5.6 12.17,72.67 13.46,71.37 13.46,69.21 11.25,67 11.25,51.25 21.25,41.25 v22,41.25
PCM_FS  (via drill 0.6)
  Top 0.305: U$2.60 v24.25,38.25
  Bottom 0.305: P5.4 9.63,72.67 10.92,71.37 10.92,68.92 10.5,68.5 10.5,51 23.25,38.25 v24.25,38.25
PWRDWN
  Top 0.305: U$2.42 33.25,47.25 32.25,48.25 32.25,49.25 35,52 53.75,52 55.5,50.25 55.5,41.5 52.75,38.75 U$1.25
PWRFAULT  (via drill 0.6)
  Top 0.305: U$2.40 34.25,48.25 v33.75,48.75 | v33.5,63 33.5,65.25 27,71.75 27,71.77 v26.5,72.27
  Bottom 0.305: v33.75,48.75 33.75,49 34,49.25 34,62.5 v33.5,63 | P1.12 15.98,76.5 20.5,76.5 21,76 21,74 22.73,72.27 v26.5,72.27 R24.1
RESET  (via drill 0.6)
  Top 0.305: U$2.34 37.25,47 v38.75,48.5
  Bottom 0.305: P1.11 15.94,74 17.5,74 26,65.5 R22.1 34.5,64.58 34.5,50 37,47.5 37.75,47.5 v38.75,48.5
SCL  (via drill 0.6)
  Top 0.305: U$2.1 v30.25,36.25
  Bottom 0.305: v30.25,36.25 29.5,37 29.5,42.5 24.75,47.25 17,47.25 16,48.25 16,64 15.5,64.5 R26.2 14.58,67.33 16.5,69.25 16.5,72.75 15.25,74 14,74 13.5,74.5 13.5,76 13,76.5 8.36,76.5 P1.5
SDA  (via drill 0.6)
  Top 0.305: U$2.18 38.5,36.75 38.25,36.5 38.25,35.75 v39.25,34.75
  Bottom 0.305: P1.3 5.78,74 12.75,74 13.5,73.25 13.5,72 14,71.5 15.25,71.5 16,70.75 16,69.5 13,66.5 13,63.25 14.25,62 R25.2 14.58,48.92 16.75,46.75 24.5,46.75 29,42.25 29,35.5 29.5,35 39,35 v39.25,34.75
STDBY  (via drill 0.6)
  Top 0.305: U$2.35 36.75,48 v37.25,48.5
  Bottom 0.305: P1.13 17.27,75.23 24.75,67.75 R21.1 34.5,67.75 35,67.25 35,50.75 v37.25,48.5
SUB+
  Top 0.61: SUB.1 96.5,26.46 C32.1 | L_LPF3.2 87,26.5 88,27.5 88,33.35 CP_5.2
  Top 1.27: L_LPF3.2 87.35,26.5 C_LPF3.2 96.46,23.85 SUB.1
SUB-
  Top 0.61: L_LPF4.2 87,13.5 88,12.5 88,6.65 CP_8.1 | C34.2 96.54,16.15 SUB.4
  Top 1.27: SUB.4 90.04,16.19 C_LPF3.1 87.35,13.5 L_LPF4.2
TH-WAR  (via drill 0.6)
  Top 0.305: P1.18 23.5,76.6 23.5,74.5 24,74 28.75,74 30.5,72.25 R1.1 34.25,72.25 35,71.5 35,68 v39.5,63.5 | U$1.28 49,40.25 48,41.25 48,46 46.75,47.25 45.75,47.25 v44.75,48.25
  Bottom 0.305: v39.5,63.5 39.5,53.5 v44.75,48.25
TRISTATE
  Top 0.305: U$1.26 52.5,39.25 55,41.75 55,50 53.5,51.5 35.25,51.5 32.75,49 32.75,48.5 33.75,47.5 U$2.41
VCC3.3  (via drill 0.6)  (1 unrouted)
  Top 0.305: U$2.46 31.25,46.75 v31,47 30.75,46.75 U$2.47 30.75,45 29.5,43.75 U$2.49 | 33.5,34.6 U$2.7 | U$2.8 33.5,34.6 | 33.5,34.6 33.5,35.25 | 33.5,35.25 33,35.75 31.25,35.75 30.75,35.25 U$2.2 30.75,33.75 30.5,33.5 24.5,33.5 v21.5,30.5 | C5.2 53.5,37 52.75,37.75 U$1.23 | U$2.22 v41,38.75 41,39 40.75,39.25 U$2.23 | U$2.16 37.75,35.75 37.25,36.25 v33.5,36.25 33.5,35.25
  Top 0.406: 38.5,72.25 v39,72.25 38.98,72.27 38.48,72.27 | 38.5,72.25 36.44,72.25 R24.2 | R23.2 R1.2 R24.2 | R24.2 38.48,72.27 | 38.48,72.27 38.5,72.25
  Top 0.61: v33,52.25 33.75,53 v42.25,53 54,53 56.5,50.5 56.5,36.35 C5.2
  Bottom 0.305: R19.2 4.5,20 13.5,29 20,29 v21.5,30.5
  Bottom 0.406: C43.1 29.1,48.9 v31,47 | v31,47 31,45.5 | v33.5,36.25 32.25,36.25 30.25,38.25 30.25,42.75 24.1,48.9 C44.1 17.42,53.23 R25.1 R26.1 | v31,47 31,38.5 32.25,37.25 39.5,37.25 v41,38.75 | v39,72.25 R1.2 R23.2 R21.2 R22.2
  Bottom 0.61: C44.1 C43.1 | 29.1,48.9 29.65,48.9 v33,52.25
  Bottom 0.813: v42.25,53 42.25,63.5 39,66.75 v39,72.25 50.75,72.25 53.19,74.69 VOLTAGE.2
VCC_PWR  (via drill 0.6)
  Top 0.305: U$1.7 59.25,41.25 59,41.5 59,42 59,42.5 59.25,42.75 U$1.4 | U$1.12 59.25,38.75 59,38.5 59,38 59,37.5 59.25,37.25 U$1.15
  Top 0.61: R8.2 v90.5,66.5 | R10.1 v90.5,53.5
  Top 0.813: 59,42 v58.5,42 | 59,38 v58.5,38 | C11.- 55.5,68 v57.5,68
  Bottom 0.305: 87,43.5 87,77
  Bottom 0.61: v90.5,53.5 87,53.5 | v90.5,66.5 87,66.5
  Bottom 0.813: v58.5,42 58.5,44 60,45.5 74.5,45.5 76,44 76,41.5 75.65,41.15 C10.1 C8.1 83.65,41.15 85,42.5 85,73 84,74 62,74 | C9.1 76,38.85 | 76,38.85 C7.1 86.35,38.85 89.5,42 C25.+ 88.27,42.23 87,43.5 87,53.5 87,66.5 87,76.5 87.5,77 | v58.5,38 58.5,36 60,34.5 74.5,34.5 76,36 76,38.85 | C22.+ 88.27,77.77 87.5,77 | VOLTAGE.6 63.5,77 | 63.5,77 87,77 87.5,77 | VOLTAGE.5 60.81,75.19 62,74 | v57.5,68 62,72.5 62,74 | 63.5,77 63.5,75.5 62,74
VCCSIG  (via drill 0.6)
  Top 0.305: U$1.35 50.5,43.75 50.25,44 50.5,44.25 U$1.36
  Top 0.61: 50.25,44 50,44 49.75,44.25 49.75,47.5 v49.25,48
  Bottom 0.61: C3.2 53.5,40.75 56.5,43.75 56.5,46 55.35,47.15 C2.2 51.35,47.15 50.5,48 v49.25,48